# Altium schematic sheet Power Schematic.SchDoc
size A4; SheetNumber: 3; SheetTotal: 3
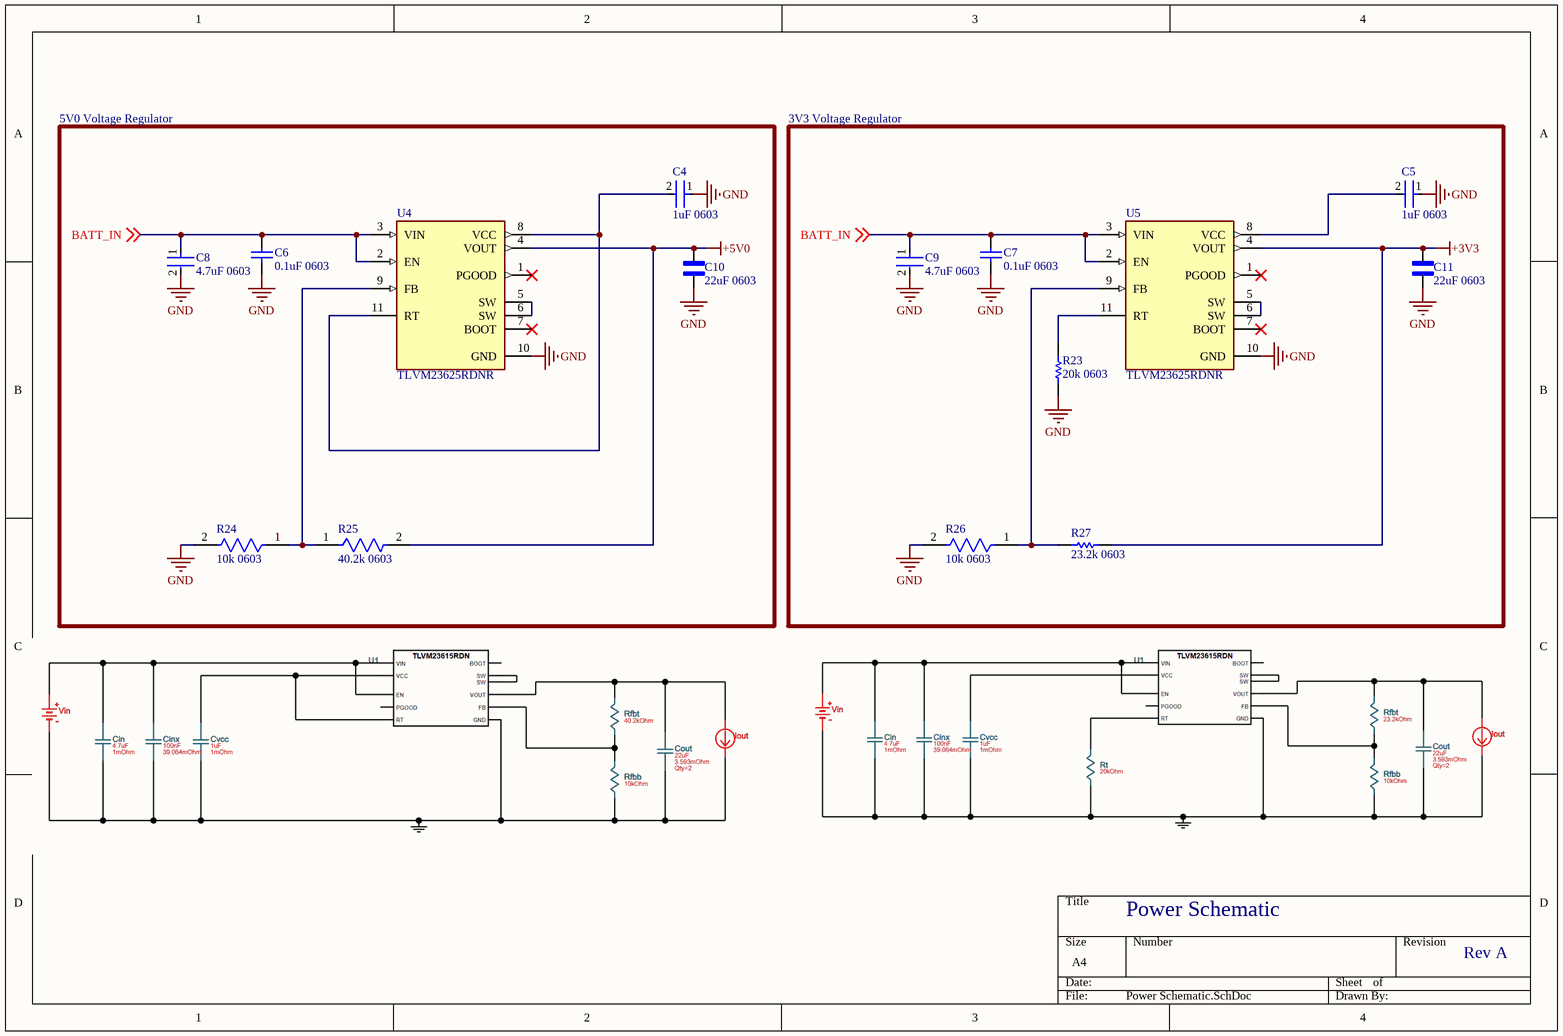
[diagram p0: Power Schematic.SchDoc]

## Parts
C4  1uF 0603  [FP-CC0603-DA-MFG]
C5  1uF 0603  [FP-CC0603-DA-MFG]
C6  0.1uF 0603  [CAPC1608X90X40LL10T20]
C7  0.1uF 0603  [CAPC1608X90X40LL10T20]
C8  4.7uF 0603  [FP-CC0603-DA-MFG]
C9  4.7uF 0603  [FP-CC0603-DA-MFG]
C10  22uF 0603  [CAPC1608X90]
C11  22uF 0603  [CAPC1608X90]
R23  20k 0603  [RESC1608X55X25NL10T15]
R24  10k 0603  [FP-RC0603-0_55-IPC_C]
R25  40.2k 0603  [FP-RC0603-0_55-IPC_C]
R26  10k 0603  [FP-RC0603-0_55-IPC_C]
R27  23.2k 0603  [RESC1608X55X25NL10T15]
U4  TLVM23625RDNR  [CONV_TLVM23625RDNR]
U5  TLVM23625RDNR  [CONV_TLVM23625RDNR]

## Blocks framed on the sheet
5V0 Voltage Regulator: C4 C6 C8 C10 R24 R25 U4
3V3 Voltage Regulator: C5 C7 C9 C11 R23 R26 R27 U5

## Nets
+3V3: C11.1 R27.2 U5.4(VOUT)
+5V0: C10.1 R25.2 U4.4(VOUT)
GND: C4.1 C5.1 C6.1 C7.1 C8.2 C9.2 C10.2 C11.2 R23.1 R24.2 R26.2 U4.10(GND) U5.10(GND)
BATT_IN: C6.2 C7.2 C8.1 C9.1 U4.2(EN) U4.3(VIN) U5.2(EN) U5.3(VIN) ; off-sheet BATT_IN
NetC4_2: C4.2 U4.8(VCC) U4.11(RT)
NetC5_2: C5.2 U5.8(VCC)
NetR23_2: R23.2 U5.11(RT)
NetR24_1: R24.1 R25.1 U4.9(FB)
NetR26_1: R26.1 R27.1 U5.9(FB)
NetU4_5: U4.5(SW) U4.6(SW)
NetU5_5: U5.5(SW) U5.6(SW)

Not connected (* = marked no-connect by the designer): U4 1(PGOOD)* 7(BOOT)*; U5 1(PGOOD)* 7(BOOT)*

## Notes on the sheet
- Power Schematic
- Rev A

## Library data of the parts
C4 C5 = CMP-03422-000612-1: CAP CER 1UF 25V X5R 0603; Manufacturer: YAGEO; Manufacturer Part Number: CC0603KRX5R8BB105; Material: Ceramic; Tolerance: 0.1; Temperature Coefficient: 15%; Automotive: No; Octopart: https://octopart.com/cc0603krx5r8bb105-yageo-9292811; Package: CC0603-DA; Temperature Range High: +125°C; Digikey Description: CAP CER 1UF 25V X5R 0603; Mouser Description: Multilayer Ceramic Capacitors MLCC - SMD/SMT 1.0uF 25V X5R 10%; Device Class L2: Capacitors; Category: Cap; Value: 1 uF; Temperature: -55°C to +125°C; ComponentLink2URL: http://www.yageo.com/documents/recent/UPY-GPHC_X7R_6.3V-to-50V_18.pdf; Capacitance: 1 uF; ComponentLink2Description: Datasheet; Voltage: 25 V; Height: 0.9mm; Device Class L3: Ceramic Capacitors; Temperature Characteristic: X5R; Footprint Url: http://www.yageo.com/exep/pages/download/literatures/UPY-C_GEN_24.pdf; Temperature Range Low: -55°C; Device Class L1: Passive Components; Voltage Rating: 25 V; Lead Free: Yes; RoHS: TRUE
C6 C7 = CMP-1035-02594-2: Chip Capacitor, 100 nF, - 20% to + 80%, 50 V, -30 to 85 degC, 0603 (1608 Metric), RoHS, Tape and Reel; Manufacturer: Yageo; Tolerance: -20%,+80%; Capacitance: 0.1µF; Product Training Modules: MultilayerCeramicCapacitors; Temperature Coefficient: Y5V(F); Kits: CC060300000000000-ND-MLCC0603SAMPLEKIT; Other Names: 311-1343-1; Featured Product: CommodityMultilayerCeramicCapacitors–CCSeries; Online Catalog: CCSeries; Voltage - Rated: 50V; Mounting Type: SurfaceMount,MLCC; Package Description: 2-Pin Surface Mount Device, Body 1.6 x 0.8 mm; Ratings: -; Lead Spacing: -; Standard Package: 1; Applications: GeneralPurpose; Size / Dimension: 0.063"Lx0.031"W(1.60mmx0.80mm); Package Reference: 0603; Operating Temperature: -30°C~85°C; Features: -; Height - Seated (Max): -; Thickness (Max): 0.035"(0.90mm); Series: CC; Datasheet URL: https://datasheet.ciiva.com/17434/upy-gphc-y5v-6-3v-to-50v-5-17434523.pdf; Family: CeramicCapacitors; Mounting Technology: SurfaceMount; Packaging: CutTape(CT); Package / Case: 0603(1608Metric); Manufacturer URL: http://www.yageo.com/; Category: Capacitors; Lead Style: -; Datasheet Version: Rev. 5, 07/2010
C8 C9 = CMP-03422-001236-1: CAP CER 4.7UF 16V X5R 0603; Manufacturer: YAGEO; Manufacturer Part Number: CC0603KRX5R7BB475; Temperature Coefficient: 15%; Material: Ceramic; Tolerance: 0.1; Temperature Characteristic: X5R; Footprint Url: http://www.yageo.com/exep/pages/download/literatures/UPY-C_GEN_24.pdf; ComponentLink2URL: http://www.yageo.com/documents/recent/UPY-GPHC_X7R_6.3V-to-50V_18.pdf; ComponentLink2Description: Datasheet; Device Class L3: Ceramic Capacitors; Category: Cap; Voltage Rating: 16 V; Automotive: No; Temperature Range High: +125°C; Value: 4.7 uF; Device Class L1: Passive Components; RoHS: TRUE; Device Class L2: Capacitors; Voltage: 16 V; Height: 0.9mm; Temperature Range Low: -55°C; Temperature: -55°C to +125°C; Capacitance: 4.7 uF; Mouser Description: Multilayer Ceramic Capacitors MLCC - SMD/SMT 4.7uF 16V X5R 10%; Octopart: https://octopart.com/cc0603krx5r7bb475-yageo-34978295; Package: CC0603-DA; Lead Free: Yes; Digikey Description: CAP CER 4.7UF 16V X5R 0603
C10 C11 = CC0603MRX5R6BB226: Cap Ceramic 22uF 10V X5R 20% SMD 0603 85Â°C Paper T/R; MF: {'manufacturer': u'Yageo'}; Package: None; Price: None; Value: *; MP: CC0603MRX5R6BB226; Availability: Unavailable
R23 = CMP-2000-04254-1: Part Number: RC0603JR-0720RL; Manufacturer: Yageo
R24 R26 = CMP-2100-03664-2: RES 10K OHM 1% 1/10W 0603; Voltage Rating: 75V; Voltage Rating (DC): 50V; Resistance: 10kR; Power Rating: 100mW; Temperature Coefficient: 100ppm/°C; Depth: 0.8mm; Termination: SMD/SMT; Resistor Type: Thick Film; Series: RC; Construction: Rectangular; Features: Moisture Resistant; Packaging: Tape and Reel; Min Operating Temperature: -55°C; Number of Terminations: 2; Lead Pitch: 0.3mm; RoHS Compliant: Yes; Case/Package: 0603; Resistance Tolerance: 1%; Military Standard: Not; Weight: 7.1E-05oz; Number of Pins: 2; Tolerance: 1%; Length: 1.6mm; Case Code (Imperial): 0603; Lead Free: Lead Free; Width: 0.8mm; Max Power Dissipation: 100mW; Height: 0.45mm; Max Operating Temperature: 155°C; Case Code (Metric): 1608; Size Code: 0603
R25 = CMP-03412-037816-1: RES 40.2K OHM 1% 1/10W 0603; Power Rating: 100mW; Resistance: 40.2kR; Voltage Rating: 50V; Working Voltage: 75V; Temperature Coefficient: 100ppm/°C; Construction: Rectangular; RoHS Compliant: Yes; Military Standard: Not; Min Operating Temperature: -55°C; Resistor Type: Thick Film; Depth: 0.8mm; Features: Moisture Resistant; Case Code (Imperial): 0603; Number of Terminations: 2; Series: RC; Width: 0.8mm; Height: 0.45mm; Packaging: Tape and Reel; Length: 1.6mm; Case Code (Metric): 1608; Termination: SMD/SMT; Max Operating Temperature: 155°C; Voltage Rating (DC): 50V; Max Power Dissipation: 100mW; Tolerance: 1%; Case/Package: 0603; Lead Free: Lead Free; Technology: METAL OXIDE FILM; Mount: Surface Mount
R27 = CMP-2000-03962-1: Part Number: RC0603FR-0723K2L; Manufacturer: Yageo
U4 U5 = TLVM23625RDNR: MF: {'manufacturer': u'Texas Instruments'}; Package: None; Price: None; Value: *; MP: TLVM23625RDNR; Availability: Unavailable